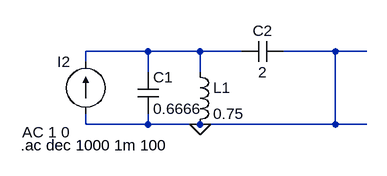
[diagram p0: schematic ej1_b.asc]
ej1_b.asc, the LTspice schematic file:
Version 4
SHEET 1 880 680
WIRE 96 96 0 96
WIRE 176 96 96 96
WIRE 240 96 176 96
WIRE 384 96 304 96
WIRE 432 96 384 96
WIRE 0 112 0 96
WIRE 96 128 96 96
WIRE 176 128 176 96
WIRE 0 208 0 192
WIRE 96 208 96 192
WIRE 96 208 0 208
WIRE 176 208 96 208
WIRE 384 208 384 96
WIRE 384 208 176 208
WIRE 432 208 384 208
FLAG 176 208 0
SYMBOL cap 304 80 R90
WINDOW 0 0 32 VBottom 2
WINDOW 3 32 32 VTop 2
SYMATTR InstName C2
SYMATTR Value 2
SYMBOL ind 160 112 R0
SYMATTR InstName L1
SYMATTR Value 0.75
SYMBOL cap 80 128 R0
SYMATTR InstName C1
SYMATTR Value 0.6666
SYMBOL current 0 192 R180
WINDOW 0 24 80 Left 2
WINDOW 3 24 0 Left 2
WINDOW 123 24 -28 Left 2
WINDOW 39 0 0 Left 0
SYMATTR InstName I2
SYMATTR Value ""
SYMATTR Value2 AC 1 0
TEXT -100 240 Left 2 !.ac dec 1000 1m 100

The netlist it stands for:
* ej1_b.asc
C2 0 N001 2
L1 N001 0 0.75
C1 N001 0 0.6666
I2 0 N001 AC 1 0
.ac dec 1000 1m 100
.backanno
.end